# Altium project LCA_V2.PrjPcb
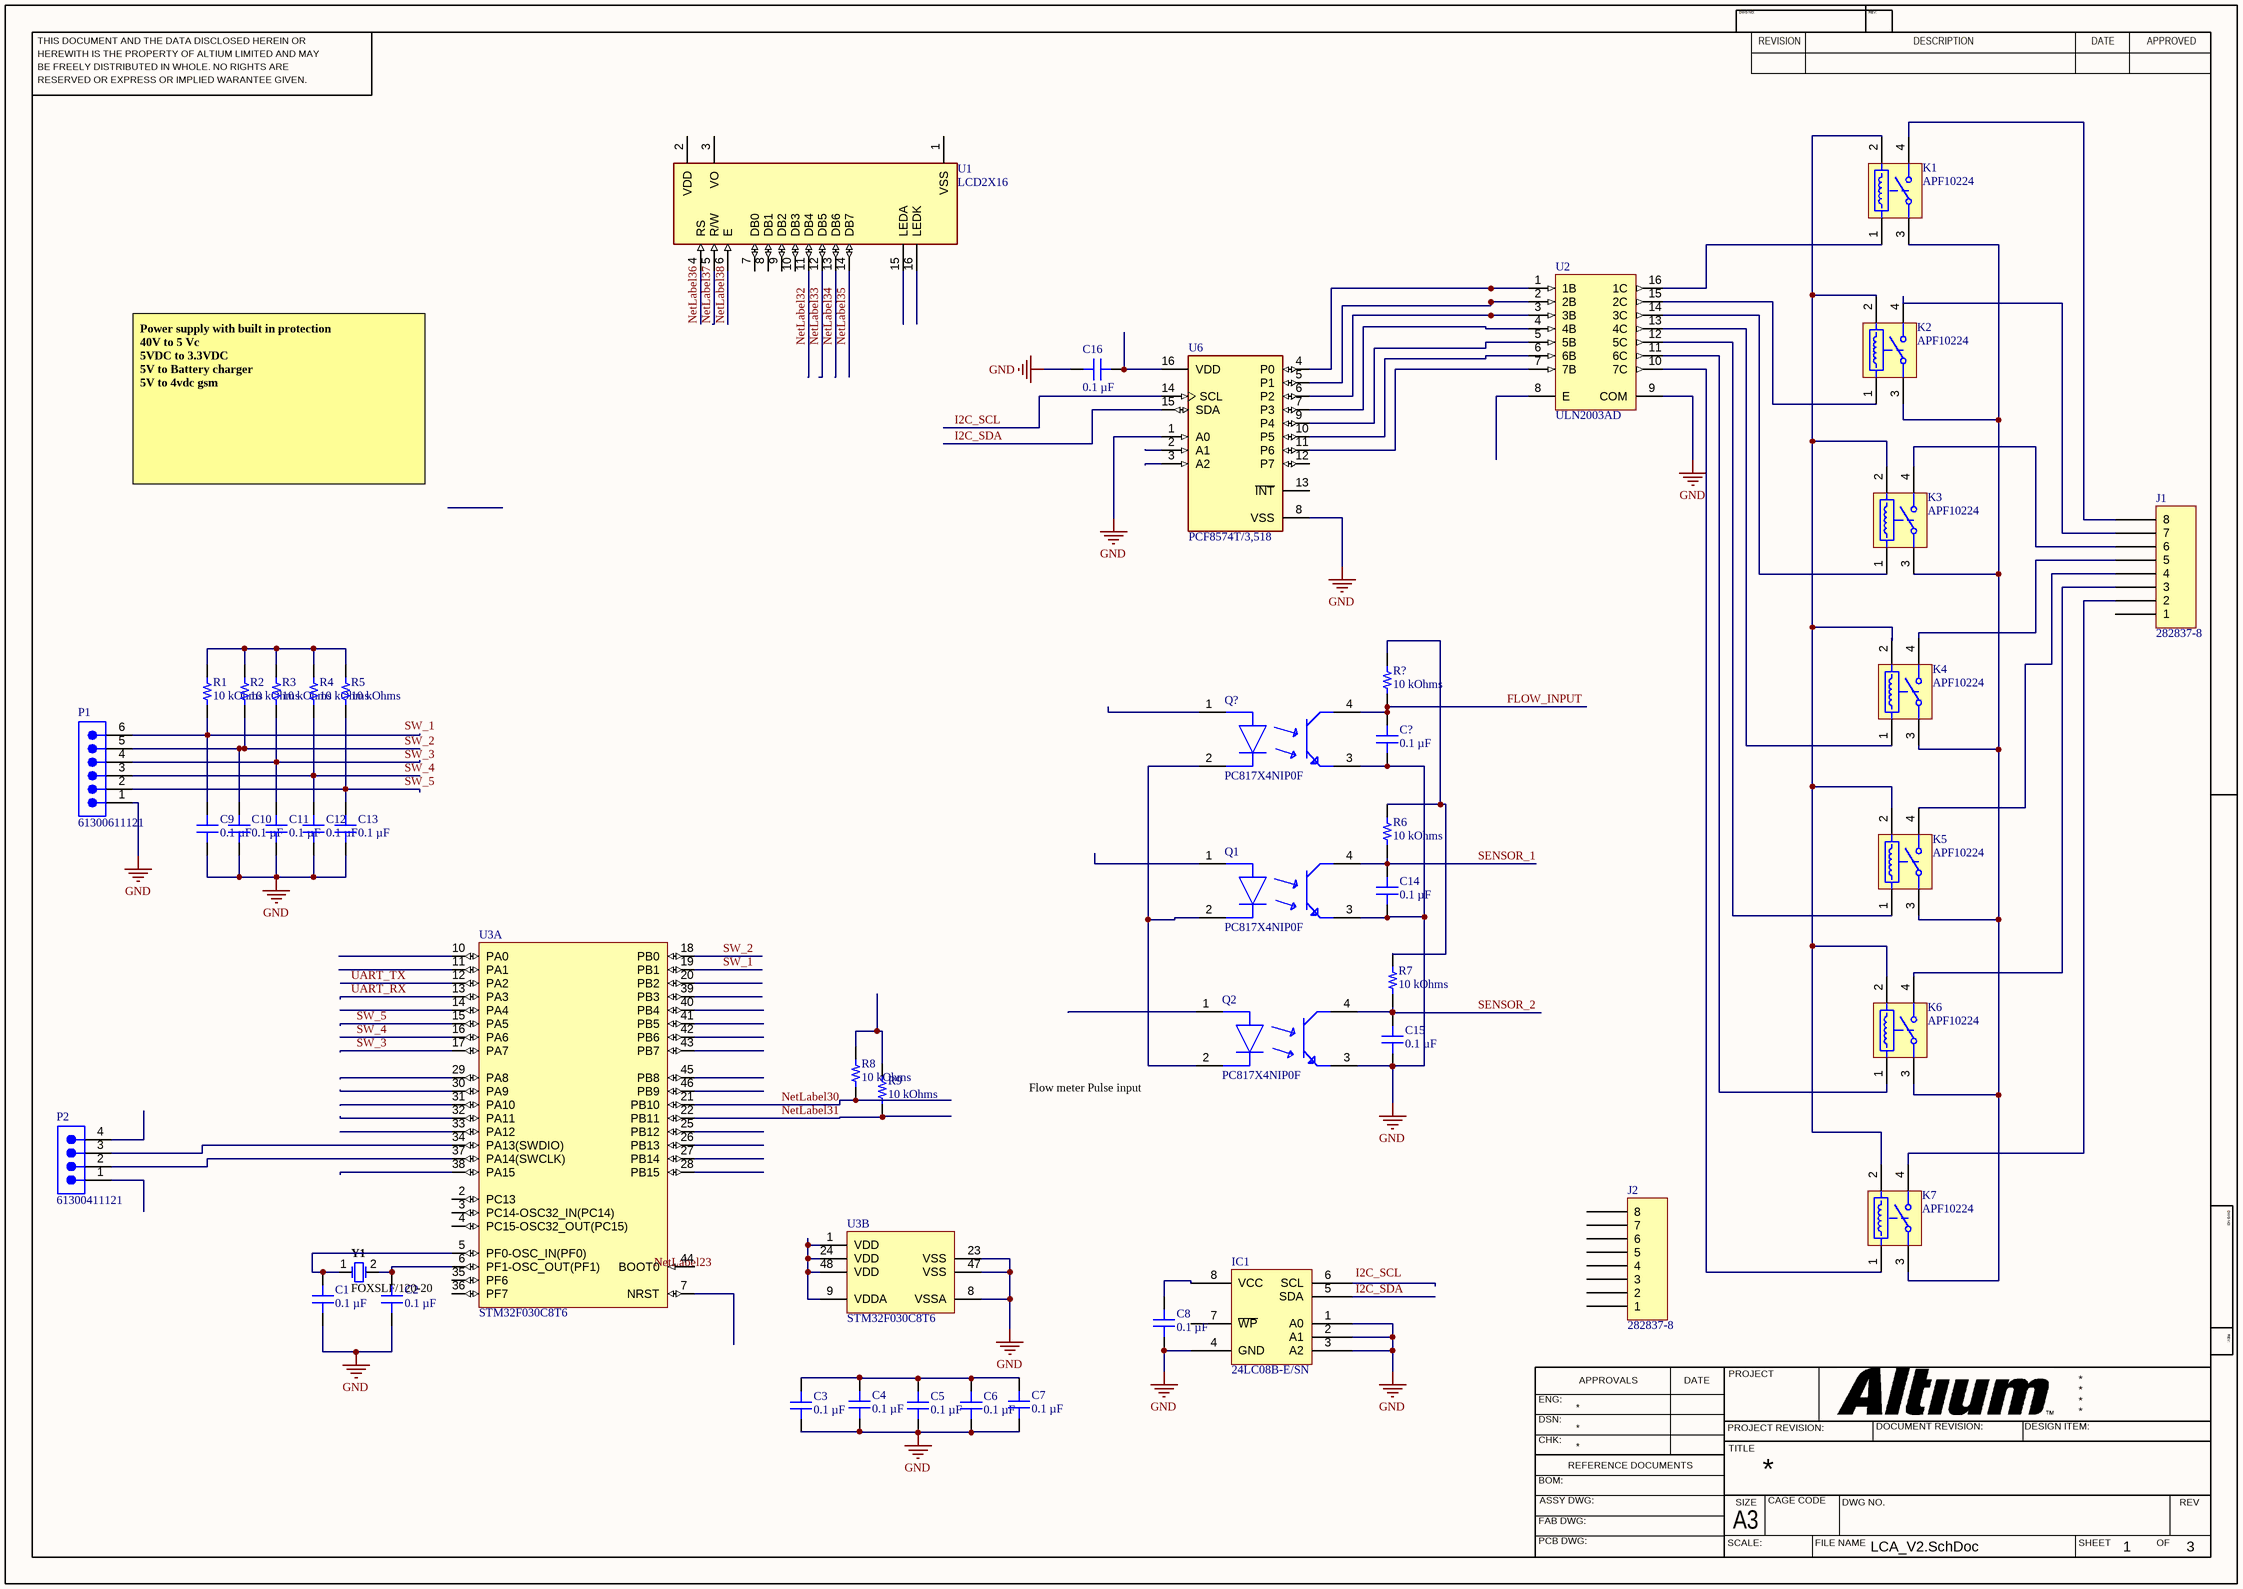
[diagram p0: LCA_V2.SchDoc]
3 sheets, 81 parts. Net scope: global (net labels, ports and power ports of the same name join across sheets).
Board file: LCA_V2.PcbDoc
Sheets:
  LCA_V2.SchDoc
  LCA_V2_power.SchDoc
  LCA_GSM.SchDoc

## Sheet LCA_V2.SchDoc
size 420 x 297 mm; SheetNumber: 1; SheetTotal: 3

### Parts
(Parts that share a designator on the sheet are numbered #1, #2 ... from top to bottom, then left to right.)
C1  0.1 µF  [CAP 0603_1608]
C2  0.1 µF  [CAP 0603_1608]
C3  0.1 µF  [CAP 0603_1608]
C4  0.1 µF  [CAP 0603_1608]
C5  0.1 µF  [CAP 0603_1608]
C6  0.1 µF  [CAP 0603_1608]
C7  0.1 µF  [CAP 0603_1608]
C8  0.1 µF  [CAP 0603_1608]
C9  0.1 µF  [CAP 0603_1608]
C10  0.1 µF  [CAP 0603_1608]
C11  0.1 µF  [CAP 0603_1608]
C12  0.1 µF  [CAP 0603_1608]
C13  0.1 µF  [CAP 0603_1608]
C14  0.1 µF  [CAP 0603_1608]
C15  0.1 µF  [CAP 0603_1608]
C16  0.1 µF  [CAP 0603_1608]
C?#1  0.1 µF  [CAP 0603_1608]
IC1  24LC08B-E/SN  [MICROCHIP SOIC-8 150MIL WIDE]
J1  282837-8  [TE 282837-8]
J2  282837-8  [TE 282837-8]
K1  APF10224  [PNSC-PF-4-2800x500x1500_V]
K2  APF10224  [PNSC-PF-4-2800x500x1500_V]
K3  APF10224  [PNSC-PF-4-2800x500x1500_V]
K4  APF10224  [PNSC-PF-4-2800x500x1500_V]
K5  APF10224  [PNSC-PF-4-2800x500x1500_V]
K6  APF10224  [PNSC-PF-4-2800x500x1500_V]
K7  APF10224  [PNSC-PF-4-2800x500x1500_V]
P1  61300611121  [61300611121]
P2  61300411121  [61300411121]
Q1  PC817X4NIP0F  [FP-PC817X4NIP0F-MFG]
Q2  PC817X4NIP0F  [FP-PC817X4NIP0F-MFG]
Q?  PC817X4NIP0F  [FP-PC817X4NIP0F-MFG]
R1  10 kOhms  [RES 0603_1608]
R2  10 kOhms  [RES 0603_1608]
R3  10 kOhms  [RES 0603_1608]
R4  10 kOhms  [RES 0603_1608]
R5  10 kOhms  [RES 0603_1608]
R6  10 kOhms  [RES 0603_1608]
R7  10 kOhms  [RES 0603_1608]
R8  10 kOhms  [RES 0603_1608]
R9  10 kOhms  [RES 0603_1608]
R?#1  10 kOhms  [RES 0603_1608]
U1  LCD2X16  [LCD_LCD2X16]
U2  ULN2003AD  [D0016A_M]
U3  STM32F030C8T6  [STM-LQFP48_L]  (parts A,B of 2)
U6  PCF8574T/3,518  [FP-SOT162-1-MFG]
Y1  FOXSLF/120-20  [FOX-FOXSLF-2_V]

### Nets
GND: C1.1 C2.1 C3.1 C4.1 C5.1 C6.1 C7.1 C8.1 C9.1 C10.1 C11.1 C12.1 C13.1 C14.1 C15.1 C16.2 C?#1.1 IC1.1(A0) IC1.2(A1) IC1.3(A2) IC1.4(GND) P1.1 Q1.3(E) Q2.3(E) Q?.3(E) U2.9(COM) U3.8(VSSA) U3.23(VSS) U3.47(VSS) U6.1(A0) U6.8(VSS)
FLOW_INPUT: C?#1.2 Q?.4(C) R?#1.1
I2C_SCL: U6.14(SCL)
I2C_SDA: IC1.5(SDA) U6.15(SDA)
NetLabel30: R8.1 U3.21(PB10)
NetLabel31: R9.1 U3.22(PB11)
NetLabel32: U1.11(DB4)
NetLabel33: U1.12(DB5)
NetLabel34: U1.13(DB6)
NetLabel35: U1.14(DB7)
NetLabel36: U1.4(RS)
NetLabel37: U1.5(R/W)
NetLabel38: U1.6(E)
SENSOR_1: C14.2 Q1.4(C) R6.1
SENSOR_2: C15.2 Q2.4(C) R7.1
SW_1: U3.19(PB1)
SW_2: C10.2 P1.5 R2.1 U3.18(PB0)
SW_3: C11.2 P1.4 R3.1 U3.17(PA7)
SW_4: C12.2 P1.3 R4.1 U3.16(PA6)
SW_5: C13.2 P1.2 R5.1 U3.15(PA5)
UART_RX: U3.13(PA3)
UART_TX: U3.12(PA2)
NetC1_2: C1.2 U3.5(PF0-OSC_IN(PF0)) Y1.1
NetC2_2: C2.2 U3.6(PF1-OSC_OUT(PF1)) Y1.2
NetC3_2: C3.2 C4.2 C5.2 C6.2 C7.2
NetC8_2: C8.2 IC1.8(VCC)
NetC9_2: C9.2 P1.6 R1.1
NetC16_1: C16.1 U6.16(VDD)
NetJ1_2: J1.2 K7.4(NO)
NetJ1_3: J1.3 K6.4(NO)
NetJ1_4: J1.4 K5.4(NO)
NetJ1_5: J1.5 K4.4(NO)
NetJ1_6: J1.6 K3.4(NO)
NetJ1_7: J1.7 K2.4(NO)
NetJ1_8: J1.8 K1.4(NO)
NetK1_1: K1.1 U2.16(1C)
NetK1_2: K1.2 K2.2 K3.2 K4.2 K5.2 K6.2 K7.2
NetK1_3: K1.3(COM) K2.3(COM) K3.3(COM) K4.3(COM) K5.3(COM) K6.3(COM) K7.3(COM)
NetK2_1: K2.1 U2.15(2C)
NetK3_1: K3.1 U2.14(3C)
NetK4_1: K4.1 U2.13(4C)
NetK5_1: K5.1 U2.12(5C)
NetK6_1: K6.1 U2.11(6C)
NetK7_1: K7.1 U2.10(7C)
NetP2_2: P2.2 U3.37(PA14(SWCLK))
NetP2_3: P2.3 U3.34(PA13(SWDIO))
NetQ1_2: Q1.2(C) Q2.2(C) Q?.2(C)
NetR1_2: R1.2 R2.2 R3.2 R4.2 R5.2
NetR6_2: R6.2 R7.2 R?#1.2
NetR8_2: R8.2 R9.2
NetU2_1: U2.1(1B) U6.4(P0)
NetU2_2: U2.2(2B) U6.5(P1)
NetU2_3: U2.3(3B) U6.6(P2)
NetU2_4: U2.4(4B) U6.7(P3)
NetU2_5: U2.5(5B) U6.9(P4)
NetU2_6: U2.6(6B) U6.10(P5)
NetU2_7: U2.7(7B) U6.11(P6)
NetU3_1: U3.1(VDD) U3.9(VDDA) U3.24(VDD) U3.48(VDD)

Not connected (* = marked no-connect by the designer): IC1 6(SCL) 7(~{WP}); J1 1; J2 1 2 3 4 5 6 7 8; P2 1 4; Q1 1(A); Q2 1(A); Q? 1(A); U1 1(VSS) 2(VDD) 3(VO) 7(DB0) 8(DB1) 9(DB2) 10(DB3) 15(LEDA) 16(LEDK); U2 8(E); U3 2(PC13) 3(PC14-OSC32_IN(PC14)) 4(PC15-OSC32_OUT(PC15)) 7(NRST) 10(PA0) 11(PA1) 14(PA4) 20(PB2) 25(PB12) 26(PB13) 27(PB14) 28(PB15) 29(PA8) 30(PA9) 31(PA10) 32(PA11) 33(PA12) 35(PF6) 36(PF7) 38(PA15) 39(PB3) 40(PB4) 41(PB5) 42(PB6) 43(PB7) 44(BOOT0) 45(PB8) 46(PB9); U6 2(A1) 3(A2) 12(P7) 13(~{INT})

### Notes on the sheet
- Power supply with built in protection
  40V to 5 Vc
  5VDC to 3.3VDC
  5V to Battery charger
  5V to 4vdc gsm
- (near Q2) Flow meter Pulse input
- Labels drawn without touching a wire or pin: I2C_SCL, NetLabel23, SW_1
- THIS DOCUMENT AND THE DATA DISCLOSED HEREIN OR
- HEREWITH IS THE PROPERTY OF ALTIUM LIMITED AND MAY
- DWG NO:
- REVISION
- REV:
- DESCRIPTION
- DATE
- APPROVED
- BE FREELY DISTRIBUTED IN WHOLE. NO RIGHTS ARE
- RESERVED OR EXPRESS OR IMPLIED WARANTEE GIVEN.
- ENG:
- APPROVALS
- PROJECT
- DSN:
- CHK:
- REFERENCE DOCUMENTS
- PROJECT REVISION:
- TITLE
- DOCUMENT REVISION:
- DESIGN ITEM:
- BOM:
- FAB DWG:
- PCB DWG:
- ASSY DWG:
- SCALE:
- A3
- SIZE
- CAGE CODE
- FILE NAME
- DWG NO.
- SHEET
- OF
- REV

### Library data of the parts
C1-C16 C?#1 = C0603C104K5RAC7411: CAP CER 0.1UF 50V X7R 0603; manufacturer: KEMET; Tolerance: ±10%; Part Number: C0603C104K5RAC7411; Value: 0.1 µF; Applications: Bypass, Decoupling; Capacitance: 0.1 µF; componentlink1description: Datasheet; componentlink1url: https://api.kemet.com/component-edge/download/datasheet/C0603C104K5RAC7411.pdf; componentlink2description: DigiKey Link; componentlink2url: https://www.digikey.com/en/products/detail/kemet/C0603C104K5RAC7411/3317013; Device Package: 0603 (1608 Metric); lastupdated: 22-01-2024 20:10:23; Lifecycle Status: Active; Minimum Order: 1; Mounting Type: Surface Mount, MLCC; Operating Temperature: -55°C ~ 125°C; Package / Case: 0603 (1608 Metric); packaging: TapeAndReel; partid: 2233; Part Status: Active; price: 0.01; series: SMD Comm X7R; Size / Dimension: 0.063" L x 0.031" W (1.60mm x 0.80mm); Supplier 1: DigiKey; Supplier Part Number 1: 399-C0603C104K5RAC7411CT-ND; Temperature Coefficient: X7R; Thickness (Max): 0.035" (0.90mm); Voltage - Rated: 50V
IC1 = 24LC08B-E/SN: IC EEPROM 8KBIT I2C 400KHZ 8SOIC; Manufacturer: Microchip Technology; Access Time: 900 ns; Memory Interface: I²C; Memory Size: 8Kb (256 x 8 x 4); Memory Type: Non-Volatile; Voltage - Supply: 2.5V ~ 5.5V; Write Cycle Time - Word, Page: 5ms; Part Number: 24LC08B-E/SN; Clock Frequency: 400 kHz; ComponentLink1Description: Datasheet; ComponentLink1URL: http://www.microchip.com/mymicrochip/filehandler.aspx?ddocname=en011847; ComponentLink2Description: DigiKey Link; ComponentLink2URL: https://www.digikey.com/en/products/detail/microchip-technology/24LC08B-E-SN/443633; LastUpdated: 06-02-2024 21:35:51; Lifecycle Status: Active; Memory Format: EEPROM; Minimum Order: 1; Mounting Type: Surface Mount; Operating Temperature: -40°C ~ 125°C (TA); Package / Case: 8-SOIC (0.154", 3.90mm Width); Packaging: Tube; PartId: 971; Part Status: Active; Price: 0.42; Series: -; Supplier 1: DigiKey; Supplier Part Number 1: 24LC08B-E/SN-ND; Supplier Device Package: 8-SOIC; Technology: EEPROM
J1 J2 = 282837-8: TERM BLK 8P SIDE ENT 5.08MM PCB; Manufacturer: TE Connectivity AMP Connectors; Current: 13.5 A; Mating Orientation: Horizontal with Board; Number of Levels: 1; Pitch: 0.200" (5.08mm); Positions Per Level: 8; Voltage: 300 V; Wire Gauge: 16-28 AWG; Wire Termination: Screw - Rising Cage Clamp; Part Number: 282837-8; Color: Green; ComponentLink1Description: Datasheet; ComponentLink1URL: https://www.te.com/commerce/DocumentDelivery/DDEController?Action=srchrtrv&DocNm=282837&DocType=Customer+Drawing&DocLang=English; ComponentLink2Description: DigiKey Link; ComponentLink2URL: https://www.digikey.com/en/products/detail/te-connectivity-amp-connectors/282837-8/2222331; Features: Interlocking (Side); LastUpdated: 21-06-2022 15:01:52; Lifecycle Status: Active; Minimum Order: 1; Mounting Type: Through Hole; Packaging: Bulk; Part Status: Active; Price: 1.64; Series: Buchanan; Supplier 1: DigiKey; Supplier Part Number 1: 282837-8-ND
K1-K7 = CMP-1503-00268-1: PF Relays, 24 V Coil Voltage, 170 mW Nominal Operating Power, -40 to 85 degC, 4-Pin PF, Tube, Case, RoHS; Manufacturer: Panasonic; Pb-Free: True; Mechanical Life(Min.operation): 5x10^6; Max Switching Current: 6 A; Nominal Operating Power: 170 mW; Max Switching Voltage: 250 V AC; Coil Voltage: 24 V; Electrical Life: 5x10^4; ComponentLink2Description: Datasheet; RoHS: True; ComponentLink1URL: http://www3.panasonic.biz/ac/ae/index.jsp; Mounting Technology: Through Hole; ComponentLink2URL: http://www3.panasonic.biz/ac/e_download/control/relay/power/catalog/mech_eng_pf.pdf?f_cd=300412; ComponentLink3URL: http://www3.panasonic.biz/ac/e_download/control/relay/power/catalog/mech_eng_pf.pdf?f_cd=300412; Series: PF Relays; PartNumber: APF10224; ComponentLink3Description: Package Specification; ComponentLink1Description: Manufacturer URL; Packing: Tube, Case; PackageReference: PF-4-2800x500x1500; PackageVersion: ASCTB205E, 02/2014; PackageDescription: 4-Pin Through Hole Terminal Package, Body 28 x 5 mm; DatasheetVersion: 201402-T
P1 = CMP-1502-01070-2: NexarPartId: 20084590; Operating Supply Voltage: 250V; Current Rating: 3A; Number of Contacts: 6; Gender: Male; Connector Type: Male Pin; Pitch: 2.54mm; Contact Resistance: 20mΩ; Lead Free: Lead Free; REACH SVHC: Unknown; Number of Rows: 1; Color: Black; Min Operating Temperature: -40°C; Contact Material: Copper; Lead Pitch: 2.54mm; Contact Plating: Gold; Number of Pins: 6; Height: 8.89mm; Orientation: Vertical; Termination: Through Hole; Mount: Through Hole; RoHS: Compliant; Contact Gender: Male; Contact Mating Length: 5.9944mm; Voltage Rating: 250V; Number of Positions: 6; Housing Material: PBT; Packaging: Bulk; Max Operating Temperature: 105°C
P2 = CMP-1502-01064-2: NexarPartId: 32855522; Pitch: 2.54mm; Number of Contacts: 4; Contact Resistance: 20mΩ; Gender: Male; Current Rating: 3A; Connector Type: Male Pin; Voltage Rating: 250V; Lead Free: Lead Free; Contact Plating: Gold; Max Operating Temperature: 105°C; Packaging: Bulk; Height: 8.89mm; Orientation: Vertical; Contact Mating Length: 5.9944mm; Contact Material: Copper; Lead Pitch: 2.54mm; Min Operating Temperature: -40°C; Termination: Solder; Color: Black; Number of Rows: 1; REACH SVHC: Unknown; RoHS: Compliant; Mount: Through Hole; Number of Positions: 4; Number of Pins: 4; Operating Supply Voltage: 250V
Q1 Q2 Q? = CMP-65434-000001-1: OPTOISOLATOR 5KV TRANS 4SMD; Manufacturer: Sharp; Collector Emitter Voltage: 80V; Standoff Height: 0.1mm; Power Dissipation: 200mW; Min Current Transfer Ratio: 50%; Reverse Voltage: 6V; Forward Current: 20mA; Forward Voltage: 1.2V; Max Current Transfer Ratio: 600%; Isolation Voltage: 5kVrms; Mouser Description: Transistor Output Optocouplers Photocoupler 300-600% CRT; RoHS: TRUE; ComponentLink2URL: https://www.sharpsde.com/fileadmin/products/Optoelectronics/Isolation%20Devices/Specs%20Photocoupler/PC817XxNIP0F_17Jun08_Spec_ED-04P129A.pdf; Lead Free: Yes; Device Class L1: Optoelectronics; ComponentLink2Description: Datasheet; Device Class L2: Optocouplers; Temperature: -30°C to +100°C; Temperature Range Low: -30°C; Automotive: No; Temperature Range High: +100°C; Octopart: https://octopart.com/pc817x4nip0f-sharp-20650453; Height: 4.6mm; Digikey Description: OPTOISOLATOR 5KV TRANS 4SMD; Category: Trans; Device Class L3: unset; Package: PC817X4NIP0F; Manufacturer Part Number: PC817X4NIP0F; Emiiter Collector Voltage: 6V
R1-R9 R?#1 = CPF0603B10KE: RES SMD 10K OHM 0.1% 1/16W 0603; Manufacturer: TE Connectivity Passive Product; Power (Watts): 0.063W, 1/16W; Temperature Coefficient: ±25ppm/°C; Part Number: CPF0603B10KE; Value: 10 kOhms; ComponentLink1Description: Datasheet; ComponentLink1URL: https://www.te.com/commerce/DocumentDelivery/DDEController?Action=srchrtrv&DocNm=1773200&DocType=DS&DocLang=English; ComponentLink2Description: DigiKey Link; ComponentLink2URL: https://www.digikey.com/en/products/detail/te-connectivity-passive-product/CPF0603B10KE/2389826; Composition: Thin Film; Device Package: 0603 (1608 Metric); Height - Seated (Max): 0.022" (0.55mm); LastUpdated: 06-02-2024 20:40:31; Lifecycle Status: Active; Minimum Order: 1; Number of Terminations: 2; Operating Temperature: -55°C ~ 155°C; Package / Case: 0603 (1608 Metric); Packaging: TapeAndReel; PartId: 4872; Part Status: Active; Price: 0.09; Resistance: 10 kOhms; Series: CPF, Neohm; Size / Dimension: 0.061" L x 0.031" W (1.55mm x 0.80mm); Supplier 1: DigiKey; Supplier Part Number 1: A119886CT-ND; Supplier Device Package: 0603; Tolerance: ±0.1%
U1 = LCD2X16: Display; Display: LCD 2x16 characters (blue backlight); Price: None; Value: *; MP: LCD2X16; Package: None; Availability: Unavailable
U2 = CMP-2000-04952-1: High-Voltage, High-Current Darlington Transistor Array, 0.5 A, 50 V, -20 to 70 degC, 16-Pin SOIC (D16), Green (RoHS & no Sb/Br), Tube; Manufacturer: TexasInstruments; Package Version: 4040047-6/M, 06/2011; Maximum Collector Emitter Voltage: 50V; Peak DC Collector Current: 0.5A; Maximum Collector Emitter Saturation Voltage: 1.1@100mA; Configuration: Array7; Category: DarlingtonBJT; Type: NPN; Manufacturer URL: http://www.ti.com/; Package: 16SOIC; Package Description: 16-Pin Plastic Small Outline, Body 9.9 x 3.9 mm, Pitch 1.27 mm; Mounting: SurfaceMount; Package URL: http://www.ti.com/lit/ml/mpds178g/mpds178g.pdf; Packaging: Rail/Tube; Datasheet Version: Rev. O, 01/2016; Datasheet URL: http://www.ti.com/general/docs/lit/getliterature.tsp?genericPartNumber=uln2003a&fileType=pdf; Package Reference: D16
U3 = CMP-0304-00024-2: ARM Cortex-M0 32-bit MCU, 64 KB Flash, 8 KB Internal RAM, 39 I/Os, 48-pin LQFP, -40 to 85 degC, Tray; FLASH Size (Prog) (kB): 64; I/Os (High Current): 39; Operating Frequency(F) (Processor speed) (MHz): 48; Supply Voltage(Vcc) min (V): 2.4; Internal RAM Size (kB): 8; Packing: Tray; ComponentLink2URL: http://www.st.com/st-web-ui/static/active/en/resource/technical/document/datasheet/DM00088500.pdf; PackageVersion: Rev. 6, 06/2013; ComponentLink2Description: Datasheet; PartNumber: STM32F030C8T6; PackageDescription: 48-Pin Low Profile Quad Flat Package, 7 x 7 mm Body, 0.5 mm Pitch; Mounting Technology: Surface Mount; ComponentLink1URL: http://www.st.com/web/en/home.html; PackageReference: LQFP48; ComponentLink3URL: http://www.st.com/st-web-ui/static/active/en/resource/technical/document/datasheet/DM00058181.pdf; DatasheetVersion: Rev. 1; Core: ARM Cortex-M0; ComponentLink1Description: Manufacturer URL; ComponentLink3Description: Package Specification
U6 = CMP-10112-000010-1: IC I/O EXPANDER I2C 8B 16SOIC; Manufacturer: NXP Semiconductors; Frequency: 100kHz; Max Supply Voltage: 6V; Standoff Height: 0.1mm; Nominal Supply Current: 40uA; Max Junction Temp: +125°C; Min Supply Voltage: 2.5V; Number Of I/Os: 8; Manufacturer Part Number: PCF8574T/3,518; Footprint Url: https://www.nxp.com/docs/en/package-information/SOT162-1.pdf; ComponentLink2URL: https://www.nxp.com/docs/en/data-sheet/PCF8574_PCF8574A.pdf; Automotive: No; Digikey Description: IC I/O EXPANDER I2C 8B 16SOIC; Mouser Description: PCF8574 Series 2.5 - 6V Remote 8-bit I/O Expander for I2C-bus - SOIC-16; Ipc Land Pattern Name: SOIC127P1032X265-16; Interface: I2C; Octopart: https://octopart.com/pcf8574t%2F3%2C518-nxp+semiconductors-10470852; Ambient Temperature Range Low: -40°C; Lead Free: Yes; Device Class L2: Interface ICs; Temperature Range High: +85°C; Device Class L1: Integrated Circuits (ICs); Package: SOT162-1; ComponentLink2Description: Datasheet; Device Class L3: I/O Expanders; Temperature: -40°C to +85°C; Ambient Temperature Range High: +85°C; Height: 2.65mm; Category: IC; RoHS: TRUE; Temperature Range Low: -40°C
Y1 = CMP-1749-00004-1: Resistance Weld Thru-Hole Crystal, 12 MHz, +/-30 ppm, -20 to 70 degC, 2-Pin THD, RoHS, Bulk; Elements: 1; Rds On Max: 115 mohm; Typical Rise Time: 90 ns; Max Power Dissipation: 2.5 W; Case\Package: TO-251-3; Input Capacitance: 350 pF; REACH SVHC: No SVHC; Length: 6.6 mm; ComponentLink1URL: http://www.foxonline.com/; PackageDescription: 2-Pin Through Hole Device, Body 11.35 x 4.65 mm, Pitch 4.88 mm; Radiation Hardening: No; Package Quantity: 70; Packaging: Rail/Tube; ComponentLink1Description: Manufacturer URL; Min Operating Temperature: -55 degC; Max Operating Temperature: 150 degC; RoHSCompliant: true; PackageReference: FOXSLF-2; DatasheetVersion: Mar-15; Pins: 3; Height: 6.1 mm; Mount: Through Hole; ComponentLink2URL: http://www.foxonline.com/pdfs/hc49slf.pdf; ComponentLink2Description: Datasheet; Width: 2.3 mm

## Sheet LCA_V2_power.SchDoc
size A4; SheetNumber: 2; SheetTotal: 3
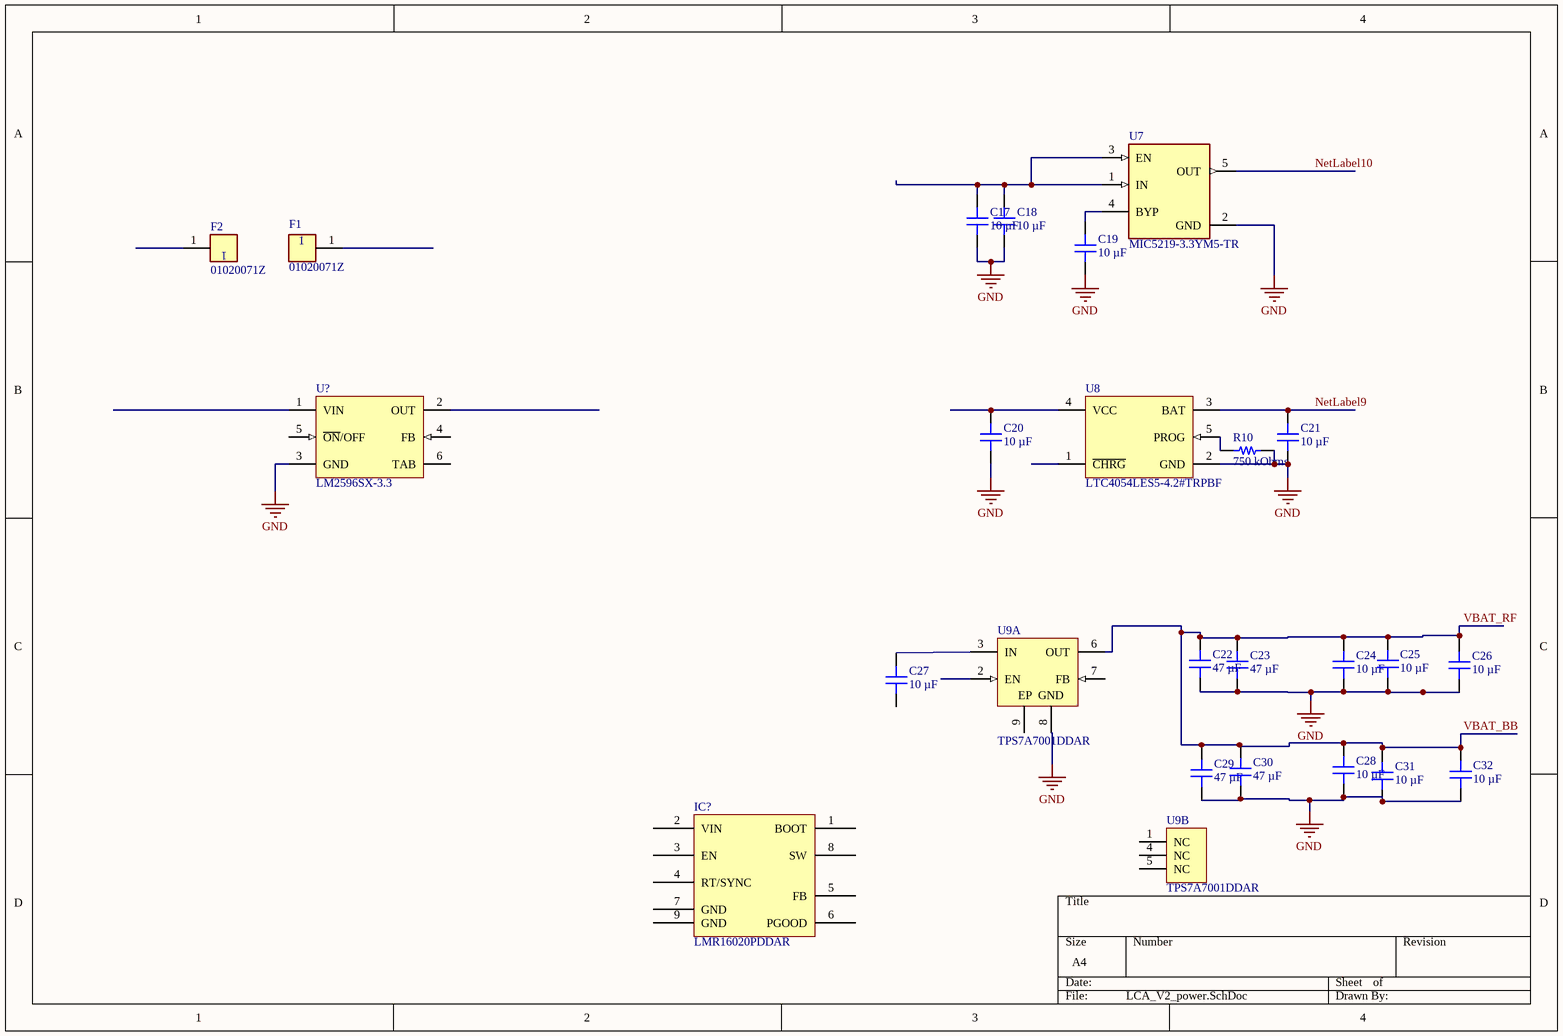
[diagram p1: LCA_V2_power.SchDoc]

### Parts
(Parts that share a designator on the sheet are numbered #1, #2 ... from top to bottom, then left to right.)
C17  10 µF  [CAP 0805_2012]
C18  10 µF  [CAP 0805_2012]
C19  10 µF  [CAP 0805_2012]
C20  10 µF  [CAP 0805_2012]
C21  10 µF  [CAP 0805_2012]
C22  47 µF  [CAP 1210_3225 - 1MM]
C23  47 µF  [CAP 1210_3225 - 1MM]
C24  10 µF  [CAP 0805_2012]
C25  10 µF  [CAP 0805_2012]
C26  10 µF  [CAP 0805_2012]
C27  10 µF  [CAP 0805_2012]
C28  10 µF  [CAP 0805_2012]
C29  47 µF  [CAP 1210_3225 - 1MM]
C30  47 µF  [CAP 1210_3225 - 1MM]
C31  10 µF  [CAP 0805_2012]
C32  10 µF  [CAP 0805_2012]
F1  01020071Z  [FP-102-MFG]
F2  01020071Z  [FP-102-MFG]
IC?  LMR16020PDDAR  [TI SOIC-8 DDA0008B]
R10  750 kOhms  [RES 0805_2012]
U7  MIC5219-3.3YM5-TR  [FP-SOT23-5LD-PL-1-IPC_C]
U8  LTC4054LES5-4.2#TRPBF  [LT-S5-5-TSOT-23_L]
U9  TPS7A7001DDAR  [DDA0008E_M]  (parts A,B of 2)
U?#1  LM2596SX-3.3  [KTT0005B_L]

### Nets
GND: C17.1 C18.1 C19.1 C20.1 C21.1 C22.1 C23.1 C24.1 C25.1 C26.1 C28.1 C29.1 C30.1 C31.1 C32.1 R10.1 U7.2(GND) U8.2(GND) U9.8(GND) U?#1.3(GND)
NetLabel9: C21.2 U8.3(BAT)
NetLabel10: U7.5(OUT)
VBAT_BB: C22.2 C23.2 C24.2 C25.2 C26.2 C28.2 C29.2 C30.2 C31.2 C32.2 U9.6(OUT)  [also labelled VBAT_RF]
NetC17_2: C17.2 C18.2 U7.1(IN) U7.3(EN)
NetC19_2: C19.2 U7.4(BYP)
NetC20_2: C20.2 U8.4(VCC)
NetC27_2: C27.2 U9.3(IN)
NetR10_2: R10.2 U8.5(PROG)

Not connected (* = marked no-connect by the designer): C27 1; F1 1; F2 1; IC? 1(BOOT) 2(VIN) 3(EN) 4(RT/SYNC) 5(FB) 6(PGOOD) 7(GND) 8(SW) 9(GND); U8 1(~{CHRG}); U9 1(NC) 2(EN) 4(NC) 5(NC) 7(FB) 9(EP); U?#1 1(VIN) 2(OUT) 4(FB) 5(~{ON}/OFF) 6(TAB)

### Library data of the parts
C17-C21 C24-C28 C31 C32 = CL21A106KQFNFNE: CAP CER 10UF 6.3V X5R 0805; manufacturer: Samsung Electro-Mechanics; Tolerance: ±10%; Part Number: CL21A106KQFNFNE; Value: 10 µF; Applications: General Purpose; Capacitance: 10 µF; componentlink1description: Datasheet; componentlink1url: http://www.samsungsem.com/kr/support/product-search/mlcc/CL21A106KQFNFNE.jsp; componentlink2description: DigiKey Link; componentlink2url: https://www.digikey.com/en/products/detail/samsung-electro-mechanics/CL21A106KQFNFNE/3888556; Device Package: 0805 (2012 Metric); lastupdated: 09-02-2024 20:16:07; Lifecycle Status: Active; Minimum Order: 1; Mounting Type: Surface Mount, MLCC; Operating Temperature: -55°C ~ 85°C; Package / Case: 0805 (2012 Metric); packaging: TapeAndReel; partid: 3259; Part Status: Active; price: 0.01; series: CL; Size / Dimension: 0.079" L x 0.049" W (2.00mm x 1.25mm); Supplier 1: DigiKey; Supplier Part Number 1: 1276-2898-1-ND; Temperature Coefficient: X5R; Thickness (Max): 0.053" (1.35mm); Voltage - Rated: 6.3V
C22 C23 C29 C30 = GRM32EC81C476KE15L: CAP CER 47UF 16V X6S 1210; manufacturer: Murata Electronics; Tolerance: ±10%; Part Number: GRM32EC81C476KE15L; Value: 47 µF; Applications: General Purpose; Capacitance: 47 µF; componentlink1description: Datasheet; componentlink1url: https://search.murata.co.jp/Ceramy/image/img/A01X/G101/ENG/GRM32EC81C476KE15-01.pdf; componentlink2description: DigiKey Link; componentlink2url: https://www.digikey.com/en/products/detail/murata-electronics/GRM32EC81C476KE15L/5027615; Device Package: 1210 (3225 Metric); lastupdated: 09-02-2024 20:44:56; Lifecycle Status: Active; Minimum Order: 1; Mounting Type: Surface Mount, MLCC; Operating Temperature: -55°C ~ 105°C; Package / Case: 1210 (3225 Metric); packaging: TapeAndReel; partid: 23627; Part Status: Active; price: 0.10; series: GRM; Size / Dimension: 0.126" L x 0.098" W (3.20mm x 2.50mm); Supplier 1: DigiKey; Supplier Part Number 1: 490-10531-1-ND; Temperature Coefficient: X6S; Thickness (Max): 0.106" (2.70mm); Voltage - Rated: 16V
F1 F2 = CMP-08604-000017-1: FUSE CLIP CARTRIDGE 250V 15A PCB; Manufacturer: Littelfuse Inc; Is Female: yes; Number Of Fuses: 1; Conn Orientation: Vertical; ComponentLink2Description: Datasheet; Mouser Description: Fuse Clips ACS 3AG PC CLIP; RoHS: TRUE; Package: 102; Category: Fuse; Voltage Rating Dc: 250V; Digikey Description: FUSE CLIP CARTRIDGE 250V 15A PCB; Automotive: No; Device Class L1: Circuit Protection; Octopart: https://octopart.com/01020071z-littelfuse-18837869; Device Class L2: Fuse Holders; Height: 10.67mm; Manufacturer Part Number: 01020071Z; Voltage Rating Ac: 250V; ComponentLink2URL: https://www.littelfuse.com/~/media/electronics/datasheets/fuse_clips/littelfuse_fuse_clip_102_122_datasheet.pdf.pdf; Fuse Current: 15A; Device Class L3: unset; Lead Free: Yes
IC? = LMR16020PDDAR: IC REG BUCK ADJUSTABLE 2A 8SOPWR; Manufacturer: Texas Instruments; Frequency - Switching: 200kHz ~ 2.5MHz; Function: Step-Down; Number of Outputs: 1; Output Configuration: Positive; Synchronous Rectifier: No; Voltage - Input (Max): 60V; Voltage - Input (Min): 4.3V; Voltage - Output (Max): 50V; Voltage - Output (Min/Fixed): 0.8V; Part Number: LMR16020PDDAR; ComponentLink1Description: Datasheet; ComponentLink1URL: http://www.ti.com/general/docs/suppproductinfo.tsp?distId=10&gotoUrl=http%3A%2F%2Fwww.ti.com%2Flit%2Fgpn%2Flmr16020; ComponentLink2Description: DigiKey Link; ComponentLink2URL: https://www.digikey.com/en/products/detail/texas-instruments/LMR16020PDDAR/6098064; Current - Output: 2A; LastUpdated: 31-05-2023 18:37:20; Lifecycle Status: Active; Minimum Order: 1; Mounting Type: Surface Mount; Operating Temperature: -40°C ~ 125°C (TJ); Output Type: Adjustable; Package / Case: 8-PowerSOIC (0.154", 3.90mm Width); Packaging: TapeAndReel; Part Status: Active; Price: 1.87; Series: SIMPLE SWITCHER®; Supplier 1: DigiKey; Supplier Part Number 1: 296-47335-1-ND; Supplier Device Package: 8-SO PowerPad; Topology: Buck
R10 = RMCF0805FT750K: RES 750K OHM 1% 1/8W 0805; Manufacturer: Stackpole Electronics Inc; Power (Watts): 0.125W, 1/8W; Temperature Coefficient: ±100ppm/°C; Part Number: RMCF0805FT750K; Value: 750 kOhms; ComponentLink1Description: Datasheet; ComponentLink1URL: https://www.seielect.com/catalog/sei-rmcf_rmcp.pdf; ComponentLink2Description: DigiKey Link; ComponentLink2URL: https://www.digikey.com/en/products/detail/stackpole-electronics-inc/RMCF0805FT750K/1760532; Composition: Thick Film; Device Package: 0805 (2012 Metric); Features: Automotive AEC-Q200; Height - Seated (Max): 0.026" (0.65mm); LastUpdated: 08-02-2024 21:02:38; Lifecycle Status: Active; Minimum Order: 1; Number of Terminations: 2; Operating Temperature: -55°C ~ 155°C; Package / Case: 0805 (2012 Metric); Packaging: CutTape; PartId: 27859; Part Status: Active; Price: 0.01; Ratings: AEC-Q200; Resistance: 750 kOhms; Series: RMCF; Size / Dimension: 0.079" L x 0.049" W (2.00mm x 1.25mm); Supplier 1: DigiKey; Supplier Part Number 1: RMCF0805FT750KCT-ND; Supplier Device Package: 0805; Tolerance: ±1%
U7 = CMP-06324-000027-1: IC REG LINEAR 3.3V 500MA SOT23-5; Dropout Voltage: 350mV; Output Type: Fixed; Number of Regulators: 1; Max Input Voltage: 12V; Min Input Voltage: 2.5V; Min Operating Temperature: -40°C; Nominal Output Voltage: 3.3V; Output Voltage: 3.3V; Packaging: Cut Tape; Mount: Surface Mount; Number of Pins: 5; Case/Package: SOT-23-5; Lead Free: Lead Free; Max Operating Temperature: 125°C; REACH SVHC: No SVHC; Output Current: 500mA
U8 = CMP-0471-00439-1: 150 mA Standalone Linear Li-Ion Battery Charger, 4.25 to 6.5 V Vin, 5-pin SOT23 (S5-5), -40 to 85 degC, Pb-Free, Tape and Reel; Manufacturer: Linear Technology; Float Voltage: 4.2 V; Vin Min(V): 4.25; Max Charge Current(A): 0.15; Battery Chemistry: Li-Ion, Li-Polymer; Charge Termination: C/10; Number of Cells: 1; Vin Max(V): 6.5; ComponentLink1URL: http://www.linear.com/; ComponentLink1Description: Manufacturer URL; PackageReference: S5-5; Mounting Technology: Surface Mount; PartNumber: LTC4054LES5-4.2#TRPBF; Type of Charger: Linear; PackageDescription: 5-Pin Plastic TSOT-23, Body 1.63 x 2.90 mm, Pitch 0.95 mm; ComponentLink3Description: Package Specification; DatasheetVersion: Rev. A; RoHS: TRUE; ComponentLink3URL: http://cds.linear.com/docs/en/packaging/SOT_5_05-08-1635.pdf; Packing: Tape and Reel; ComponentLink2URL: http://cds.linear.com/docs/en/datasheet/4054l42fa.pdf; PackageVersion: Jun-10; ComponentLink2Description: Datasheet; Code_JEDEC: MO-193
U9 = CMP-0395-00550-2: Single Output Very Low Input LDO, 2 A, Adjustable 0.9 to 5 V Output, 1.5 to 6.5 V Input, 8-pin SOPowerPAD (DDA), -40 to 125 degC, Green (RoHS & no Sb/Br); Manufacturer: Texas Instruments; Iq(Typ)(mA): 0.01; Vin(Max)(V): 6.5; Accuracy(%): 2; Vin(Min)(V): 1.5; Vout Adj(Max)(V): 5; Vout Adj(Min)(V): 0.9; SubFamily: Single Channel LDO; Vdo(Typ)(mV): 170; PartNumber: TPS7A7001DDAR; Mounting Technology: Surface Mount; ComponentLink3Description: Package Specification; ComponentLink2Description: Datasheet; DatasheetVersion: SBVS134B; PackageReference: DDA0008E; PackageVersion: 4202561/F; ComponentLink1Description: Manufacturer URL; Eco-Plan: Green (RoHS & no Sb/Br); Iout(Max)(A): 2; Code_JEDEC: MS-012; ComponentLink1URL: http://www.ti.com/; ComponentLink3URL: http://www.ti.com/litv/pdf/mpds092e; PackageDescription: 8-Pin Plastic Small Outline, Body 3.9 x 4.9 mm, Pitch 1.27 mm; ComponentLink2URL: http://www.ti.com/general/docs/lit/getliterature.tsp?genericPartNumber=TPS7A7001&fileType=pdf
U?#1 = CMP-0069-00283-3: SIMPLE SWITCHER® Power Converter 150 KHz 3A Step-Down Voltage Regulator, 5-pin TO-263; Manufacturer: Texas Instruments; PowerWise: N; PackageTopMarking: NSUZXYTTE#*LM2596S*-3.3 P+; ComponentLink1Description: Datasheet URL; ComponentLink1URL: http://www.ti.com/general/docs/lit/getliterature.tsp?genericPartNumber=LM2596&fileType=pdf; PackageDescription: TO-263, Molded, .400 x .390 x .180in, 5 Lead, .067in Pitch, Surface Mount; PinCount: 5; PackageReference: KTT0005B; RoHS: N; Code_JEDEC: MO-169-AB; CompType: Switcher

## Sheet LCA_GSM.SchDoc
size 420 x 297 mm; SheetNumber: 3; SheetTotal: 3
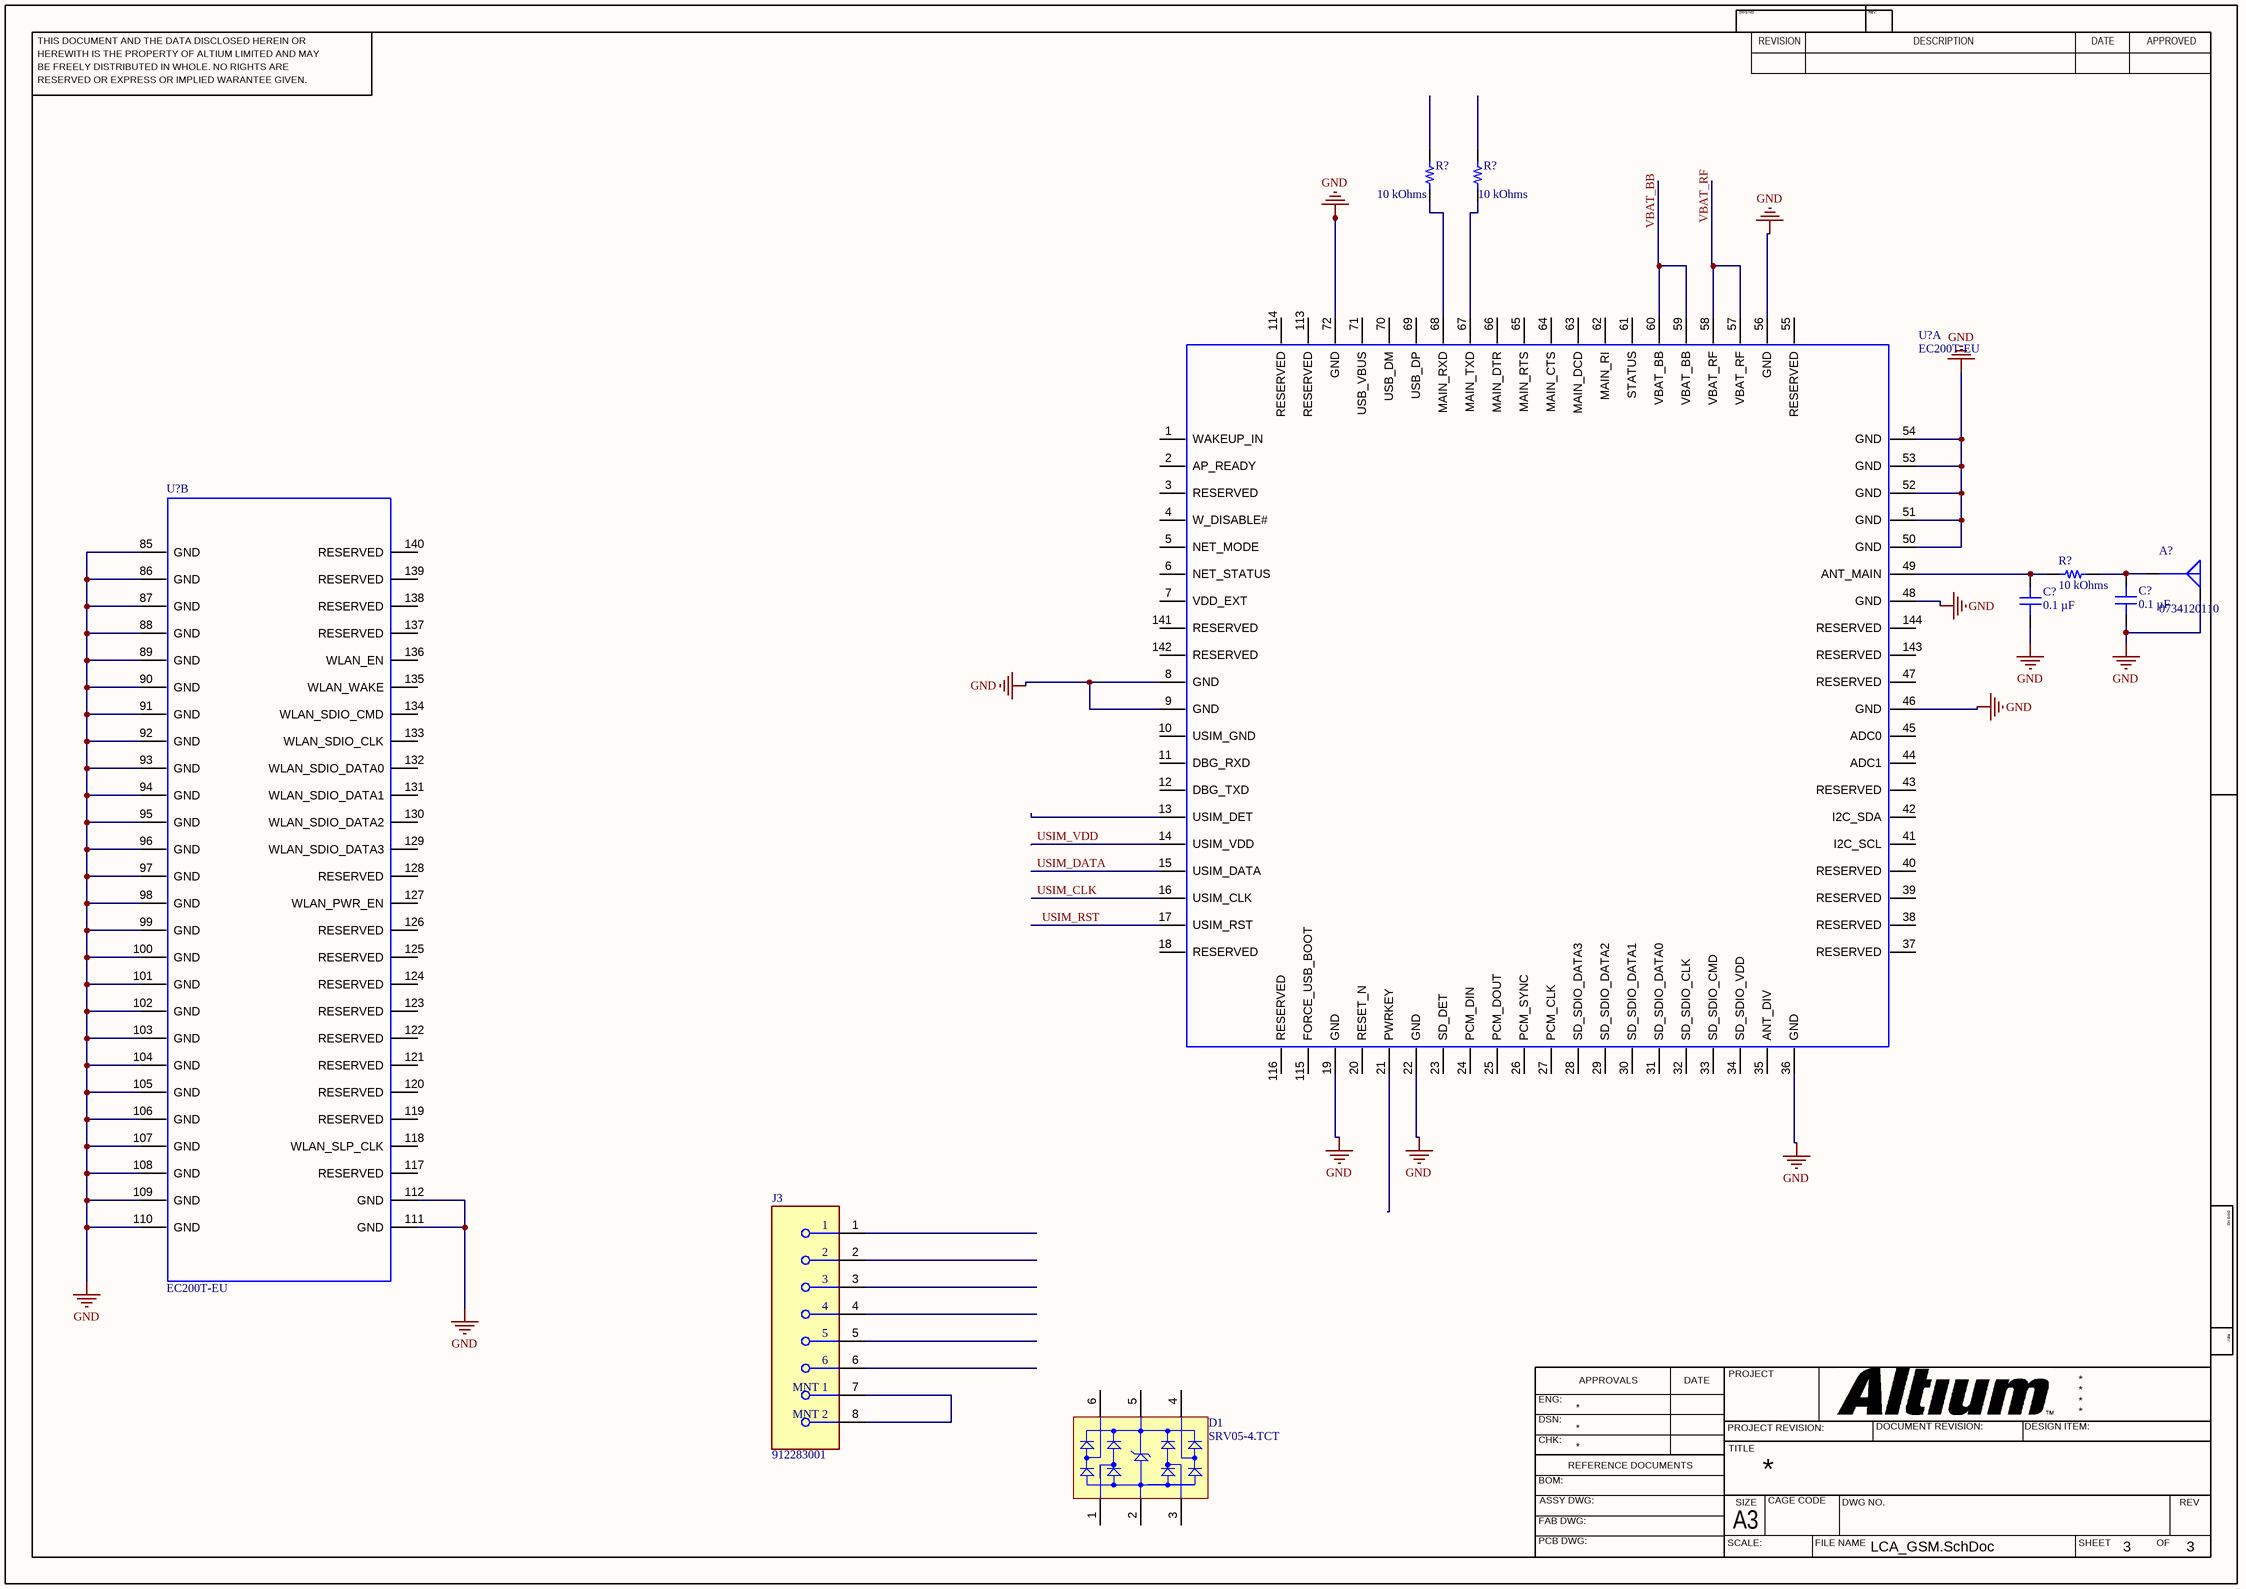
[diagram p2: LCA_GSM.SchDoc]

### Parts
(Parts that share a designator on the sheet are numbered #1, #2 ... from top to bottom, then left to right.)
A?  0734120110  [MOLEX SD-734120110]
C?#2  0.1 µF  [CAP 0603_1608]
C?#3  0.1 µF  [CAP 0603_1608]
D1  SRV05-4.TCT  [SMTC-SOT23-6_V]
J3  912283001  [FP-912283001-MFG]
R?#2  10 kOhms  [RES 0603_1608]
R?#3  10 kOhms  [RES 0603_1608]
R?#4  10 kOhms  [RES 0603_1608]
U?#2  EC200T-EU  [EC200T-CN]  (part A of 2)
U?#3  EC200T-EU  [EC200T-CN]  (part B of 2)

### Nets
GND: A?.G C?#2.1 C?#3.1 U?#2.8(GND) U?#2.9(GND) U?#2.19(GND) U?#2.22(GND) U?#2.36(GND) U?#2.46(GND) U?#2.48(GND) U?#2.50(GND) U?#2.51(GND) U?#2.52(GND) U?#2.53(GND) U?#2.54(GND) U?#2.56(GND) U?#2.72(GND) U?#3.85(GND) U?#3.86(GND) U?#3.87(GND) U?#3.88(GND) U?#3.89(GND) U?#3.90(GND) U?#3.91(GND) U?#3.92(GND) U?#3.93(GND) U?#3.94(GND) U?#3.95(GND) U?#3.96(GND) U?#3.97(GND) U?#3.98(GND) U?#3.99(GND) U?#3.100(GND) U?#3.101(GND) U?#3.102(GND) U?#3.103(GND) U?#3.104(GND) U?#3.105(GND) U?#3.106(GND) U?#3.107(GND) U?#3.108(GND) U?#3.109(GND) U?#3.110(GND) U?#3.111(GND) U?#3.112(GND)
USIM_CLK: U?#2.16(USIM_CLK)
USIM_DATA: U?#2.15(USIM_DATA)
USIM_RST: U?#2.17(USIM_RST)
USIM_VDD: U?#2.14(USIM_VDD)
VBAT_BB: U?#2.57(VBAT_RF) U?#2.58(VBAT_RF) U?#2.59(VBAT_BB) U?#2.60(VBAT_BB)  [also labelled VBAT_RF]
NetA?_S: A?.S C?#3.2 R?#4.1
NetC?#2_2: C?#2.2 R?#4.2 U?#2.49(ANT_MAIN)
NetJ3_7: J3.7(MNT_1) J3.8(MNT_2)
NetR?#2_1: R?#2.1 U?#2.68(MAIN_RXD)
NetR?#3_1: R?#3.1 U?#2.67(MAIN_TXD)

Not connected (* = marked no-connect by the designer): D1 1(I/O_1) 2(GND) 3(I/O_2) 4(I/O_3) 5(VBUS) 6(I/O_4); J3 1 2 3 4 5 6; R?#2 2; R?#3 2; U?#2 1(WAKEUP_IN) 2(AP_READY) 3(RESERVED) 4(W_DISABLE#) 5(NET_MODE) 6(NET_STATUS) 7(VDD_EXT) 10(USIM_GND) 11(DBG_RXD) 12(DBG_TXD) 13(USIM_DET) 18(RESERVED) 20(RESET_N) 21(PWRKEY) 23(SD_DET) 24(PCM_DIN) 25(PCM_DOUT) 26(PCM_SYNC) 27(PCM_CLK) 28(SD_SDIO_DATA3) 29(SD_SDIO_DATA2) 30(SD_SDIO_DATA1) 31(SD_SDIO_DATA0) 32(SD_SDIO_CLK) 33(SD_SDIO_CMD) 34(SD_SDIO_VDD) 35(ANT_DIV) 37(RESERVED) 38(RESERVED) 39(RESERVED) 40(RESERVED) 41(I2C_SCL) 42(I2C_SDA) 43(RESERVED) 44(ADC1) 45(ADC0) 47(RESERVED) 55(RESERVED) 61(STATUS) 62(MAIN_RI) 63(MAIN_DCD) 64(MAIN_CTS) 65(MAIN_RTS) 66(MAIN_DTR) 69(USB_DP) 70(USB_DM) 71(USB_VBUS) 113(RESERVED) 114(RESERVED) 115(FORCE_USB_BOOT) 116(RESERVED) 141(RESERVED) 142(RESERVED) 143(RESERVED) 144(RESERVED); U?#3 117(RESERVED) 118(WLAN_SLP_CLK) 119(RESERVED) 120(RESERVED) 121(RESERVED) 122(RESERVED) 123(RESERVED) 124(RESERVED) 125(RESERVED) 126(RESERVED) 127(WLAN_PWR_EN) 128(RESERVED) 129(WLAN_SDIO_DATA3) 130(WLAN_SDIO_DATA2) 131(WLAN_SDIO_DATA1) 132(WLAN_SDIO_DATA0) 133(WLAN_SDIO_CLK) 134(WLAN_SDIO_CMD) 135(WLAN_WAKE) 136(WLAN_EN) 137(RESERVED) 138(RESERVED) 139(RESERVED) 140(RESERVED)

### Notes on the sheet
- THIS DOCUMENT AND THE DATA DISCLOSED HEREIN OR
- HEREWITH IS THE PROPERTY OF ALTIUM LIMITED AND MAY
- DWG NO:
- REVISION
- REV:
- DESCRIPTION
- DATE
- APPROVED
- BE FREELY DISTRIBUTED IN WHOLE. NO RIGHTS ARE
- RESERVED OR EXPRESS OR IMPLIED WARANTEE GIVEN.
- ENG:
- APPROVALS
- PROJECT
- DSN:
- CHK:
- REFERENCE DOCUMENTS
- PROJECT REVISION:
- TITLE
- DOCUMENT REVISION:
- DESIGN ITEM:
- BOM:
- FAB DWG:
- PCB DWG:
- ASSY DWG:
- SCALE:
- A3
- SIZE
- CAGE CODE
- FILE NAME
- DWG NO.
- SHEET
- OF
- REV

### Library data of the parts
A? = 0734120110: CONN UMC RCPT STR 50 OHM SMD; Manufacturer: Molex; Connector Type: Receptacle, Male Pin; Contact Termination: Solder; Frequency - Max: 6GHz; Impedance: 50Ohm; Number of Ports: 1; Part Number: 0734120110; ComponentLink1Description: Datasheet; ComponentLink1URL: https://www.molex.com/pdm_docs/ps/PS-73598-021-001.pdf; ComponentLink2Description: DigiKey Link; ComponentLink2URL: http://digikey.com/product-detail/en/molex/0734120110/WM5587CT-ND/1894612; Fastening Type: Snap-On; Housing Color: Silver; LastUpdated: 29-06-2022 18:16:06; Lifecycle Status: Active; Minimum Order: 1; Mounting Type: Surface Mount; Packaging: TapeAndReel; Part Status: Active; Price: 0.32; Series: 73412; Shield Termination: Solder; Supplier 1: DigiKey; Supplier Part Number 1: WM5587CT-ND
C?#2 C?#3 = C0603C104K5RAC7411: as C1 on sheet LCA_V2; Part Number: C0603C104K5RAC7411; Value: 0.1 µF; Applications: Bypass, Decoupling; Capacitance: 0.1 µF; componentlink1description: Datasheet; componentlink1url: https://api.kemet.com/component-edge/download/datasheet/C0603C104K5RAC7411.pdf; componentlink2description: DigiKey Link; componentlink2url: https://www.digikey.com/en/products/detail/kemet/C0603C104K5RAC7411/3317013; Device Package: 0603 (1608 Metric); lastupdated: 22-01-2024 20:10:23; Lifecycle Status: Active; Minimum Order: 1; Mounting Type: Surface Mount, MLCC; Operating Temperature: -55°C ~ 125°C; Package / Case: 0603 (1608 Metric); packaging: TapeAndReel; partid: 2233; Part Status: Active; price: 0.01; series: SMD Comm X7R; Size / Dimension: 0.063" L x 0.031" W (1.60mm x 0.80mm); Supplier 1: DigiKey; Supplier Part Number 1: 399-C0603C104K5RAC7411CT-ND; Temperature Coefficient: X7R; Thickness (Max): 0.035" (0.90mm); Voltage - Rated: 50V
D1 = CMP-2000-05358-1: RailClamp(R) Low Capacitance TVS Diode Array, 5 pF, 17.5 VC, -55 to 125 degC, 6-Pin SOT23, RoHS, Tape and Reel; Manufacturer: Semtech; Leakage Current (Max): 5uA; Polarity: Uni-Directional; Peak Pulse Power Dissipation: 300W; Clamping Voltage: 17.5V; Number of Elements: 1; Working Voltage: 5V; Test Current (It): 1mA; Configuration: Quad; Reverse Breakdown Voltage: 6V; Suppressor Type: DiodeArrays; Peak Pulse Current: 12A; Product Depth (mm): 1.6mm; Product Height (mm): 1.15mm; Clamping Voltage (Max): 12.5V; Rad Hardened: No; Product Length (mm): 2.9mm; Capacitance Value: 5pF; Mounting: SurfaceMount; Datasheet URL: https://datasheet.ciiva.com/8029/srv05-4-8029973.pdf; Datasheet Version: Jan-08; Packaging: TapeandReel; Package / Case: SOT-23; Operating Temp Range: -55Cto125C; Pin Count: 6; Direction Type: Uni-Directional; Operating Temperature Min Deg. C: -55C; Reverse Stand-off Voltage: 5V; Leakage Current: 5uA; Manufacturer URL: http://www.semtech.com/; Working Voltage (Max): 5V; Package Reference: SOT23-6; Package Description: 6-Pin Small Outline Transistor, Body 2.9 x 1.6 mm, Pitch 0.95 mm; Operating Temperature Max Deg. C: 125C; Operating Temperature Classification: Military; Mounting Style: SurfaceMount
J3 = CMP-2000-05710-2: CONN SIM CARD PUSH-PUSH R/A SMD; Manufacturer: Molex; Number Of Contacts: 6; Current Rating: 0.5A; Conn Gender: Female; Is Female: yes; Pitch: 2.54mm; Voltage Rating: 50V; Conn Orientation: Right Angle; Category: Conn; Automotive: No; ComponentLink2Description: Datasheet; Mouser Description: 2.54mm Pitch ChipSIM Connector with Ejector, 6 Circuits, without Pegs, Yellow Button; Lead Free: Yes; Height: 3.1mm; Temperature Range Low: -40°C; Device Class L1: Connectors; Device Class L3: unset; Manufacturer Part Number: 912283001; Footprint Url: https://www.molex.com/pdm_docs/sd/912283001_sd.pdf; Package: 0; Temperature: -40°C to +85°C; Octopart: https://octopart.com/91228-3001-molex-7135390; Contact Material: Gold,Nickel; RoHS: TRUE; Device Class L2: Card Edge Connectors; ComponentLink2URL: https://www.molex.com/webdocs/datasheets/pdf/en-us/0912283001_MEMORY_CARD_SOCKET.pdf; Temperature Range High: +85°C; Digikey Description: CONN SIM CARD PUSH-PUSH R/A SMD
R?#2-R?#4 = CPF0603B10KE: as R1 on sheet LCA_V2; Part Number: CPF0603B10KE; Value: 10 kOhms; ComponentLink1Description: Datasheet; ComponentLink1URL: https://www.te.com/commerce/DocumentDelivery/DDEController?Action=srchrtrv&DocNm=1773200&DocType=DS&DocLang=English; ComponentLink2Description: DigiKey Link; ComponentLink2URL: https://www.digikey.com/en/products/detail/te-connectivity-passive-product/CPF0603B10KE/2389826; Composition: Thin Film; Device Package: 0603 (1608 Metric); Height - Seated (Max): 0.022" (0.55mm); LastUpdated: 06-02-2024 20:40:31; Lifecycle Status: Active; Minimum Order: 1; Number of Terminations: 2; Operating Temperature: -55°C ~ 155°C; Package / Case: 0603 (1608 Metric); Packaging: TapeAndReel; PartId: 4872; Part Status: Active; Price: 0.09; Resistance: 10 kOhms; Series: CPF, Neohm; Size / Dimension: 0.061" L x 0.031" W (1.55mm x 0.80mm); Supplier 1: DigiKey; Supplier Part Number 1: A119886CT-ND; Supplier Device Package: 0603; Tolerance: ±0.1%
U?#2 U?#3 = EC200T-CN: Part Description: EC200T-EU Moudle 144PIN 29x32mm; Manufacturer: Quectel; Geometry.Height: 2.6mm; Value: EC200T-EU

## Nets that join several sheets
GND: LCA_V2 (31 pins), LCA_V2_power (20 pins), LCA_GSM (45 pins)
VBAT_BB: LCA_V2_power (11 pins), LCA_GSM (U?#2.57 U?#2.58 U?#2.59 U?#2.60)